# Altium schematic sheet RLC_filter.SchDoc: RLC filter
size A4; EDA_Number: ARTIQ; Projet: Fastino; ModifiedBy: -; CheckedDate: -; DivGrp: WUT ISE; Designer: G.Kasprowicz; CheckedBy: Maciej Przybysz; Author: Michał Piętka; Organization: Technosystem; Address1: Słoneczna 125, 05-506 Kolonia Lesznowola; Address2: https://technosystem.pl/; Address4: (NOT USED); DocumentNumber: 1; Revision: 0; SheetNumber: 1; SheetTotal: 1
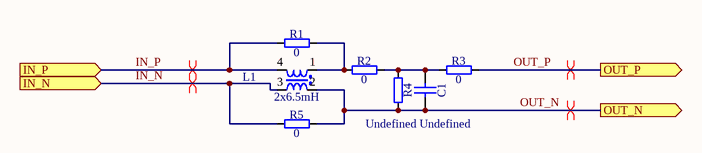
[diagram p0: RLC_filter.SchDoc]

## Parts
C1  Undefined  [CAPC2012X135N]
L1  2x6.5mH  [IND_WURTH_WE-SL2]
R1  0  [RESC1608X55N]
R2  0  [RESC1608X55N]
R3  0  [RESC1608X55N]
R4  Undefined  [RESC1608X55N]
R5  0  [RESC1608X55N]

## Ports
IN_N (in), IN_P (in), OUT_N (out), OUT_P (out)

## Nets
IN_N: L1.3 R5.2 ; port IN_N
IN_P: L1.4 R1.2 ; port IN_P
OUT_N: C1.1 L1.2 R4.1 R5.1 ; port OUT_N
OUT_P: R3.1 ; port OUT_P
NetC1_2: C1.2 R2.1 R3.2 R4.2
NetL1_1: L1.1 R1.1 R2.2

## Layout directives
differential pair: IN_N, IN_P, OUT_N, OUT_P

## Notes on the sheet
- Project:
- Version:
- Designed by:
- Checked by:
- Filename:
- Size:
- Date:
- Sheet:
- A4

## Library data of the parts
C1 = CC0805_NO-VALUE: Non-polarised capacitor; Part Description: Reserved Footprint For 0805(2012) Chip Ceramic Capacitor; Mounted: No; Part Number: CC0805_NO-VALUE; Component Kind: Standard; Component Type: Standard; Pin Count: 2; Value: Undefined; Status: None; Manufacturer: Undefined; Manufacturer Part Number: CC0805_NO-VALUE; Case: 0805; Socket: No; SMD: Yes; Sense: No; Manufacturer1 ComponentHeight: 1.35mm; HelpURL: Undefined; Author: CERN DEM JLC; CreateDate: 10.12.2008; LatestRevisionDate: 11.09.2013
L1 = IND_6.5MH_50%_WURTH_WE-SL2-744229: Inductor Common Mode; Part Description: Common Mode SMD Line Filter (WE-SL2 Serie); Manufacturer: WURTH ELEKTRONIK; Manufacturer Part Number: 744229; Power: 400mA; Resistance: 0.95R; Tolerance: ±50%; Part Number: IND_6.5MH_50%_WURTH_WE-SL2-744229; Component Kind: Standard; Component Type: Standard; Pin Count: 4; Value: 2x6.5mH; Status: None; Mounted: Yes; Socket: No; SMD: Yes; Sense: No; ComponentHeight: 5.3mm; HelpURL: \\cern.ch\dfs\Applications\Altium\Datasheets\IND_WURTH_WE-SL2_744229.pdf; Author: CERN DEM JLC; CreateDate: 01.10.2012; LatestRevisionDate: 15.10.2012
R1-R3 R5 = R0603_0R_JUMPER: Resistor; Part Description: 1A (0.05R Max DC Resistance) Zero Ohm Jumper; Manufacturer: GENERIC; Manufacturer1 Part Number: NRC06Z0; Part Number: R0603_0R_JUMPER; Component Kind: Standard; Component Type: Standard; Pin Count: 2; Value: 0; Status: Preferred; Manufacturer Part Number: R0603_0R_JUMPER; Case: 0603; Mounted: Yes; Sense: No; Socket: No; SMD: Yes; Manufacturer1 Example: NIC COMPONENT; Manufacturer1 ComponentHeight: 0.55mm; HelpURL: \\cern.ch\dfs\Applications\Altium\Datasheets\R0603_NIC_NRC.pdf; Author: CERN DEM JLC; CreateDate: 03.12.2007; LatestRevisionDate: 13.03.2008
R4 = R0603_NO-VALUE: Resistor; Part Description: Reserved Footprint For a 0603 (1608) Chip Resistor; PressFit: No; Mounted: No; Part Number: R0603_NO-VALUE; Component Kind: Standard; Component Type: Standard; Pin Count: 2; Value: Undefined; Status: None; Manufacturer: Undefined; Manufacturer Part Number: R0603_NO-VALUE; Case: 0603; Sense: No; Socket: No; SMD: Yes; Manufacturer1 Example: Undefined; Manufacturer1 Part Number: Undefined; Manufacturer1 ComponentHeight: Undefined; HelpURL: Undefined; Author: CERN DEM JLC; CreateDate: 03.12.2007; LatestRevisionDate: 13.03.2008